# Altium project ARDUINO_NANO_02_V03.PrjPcb
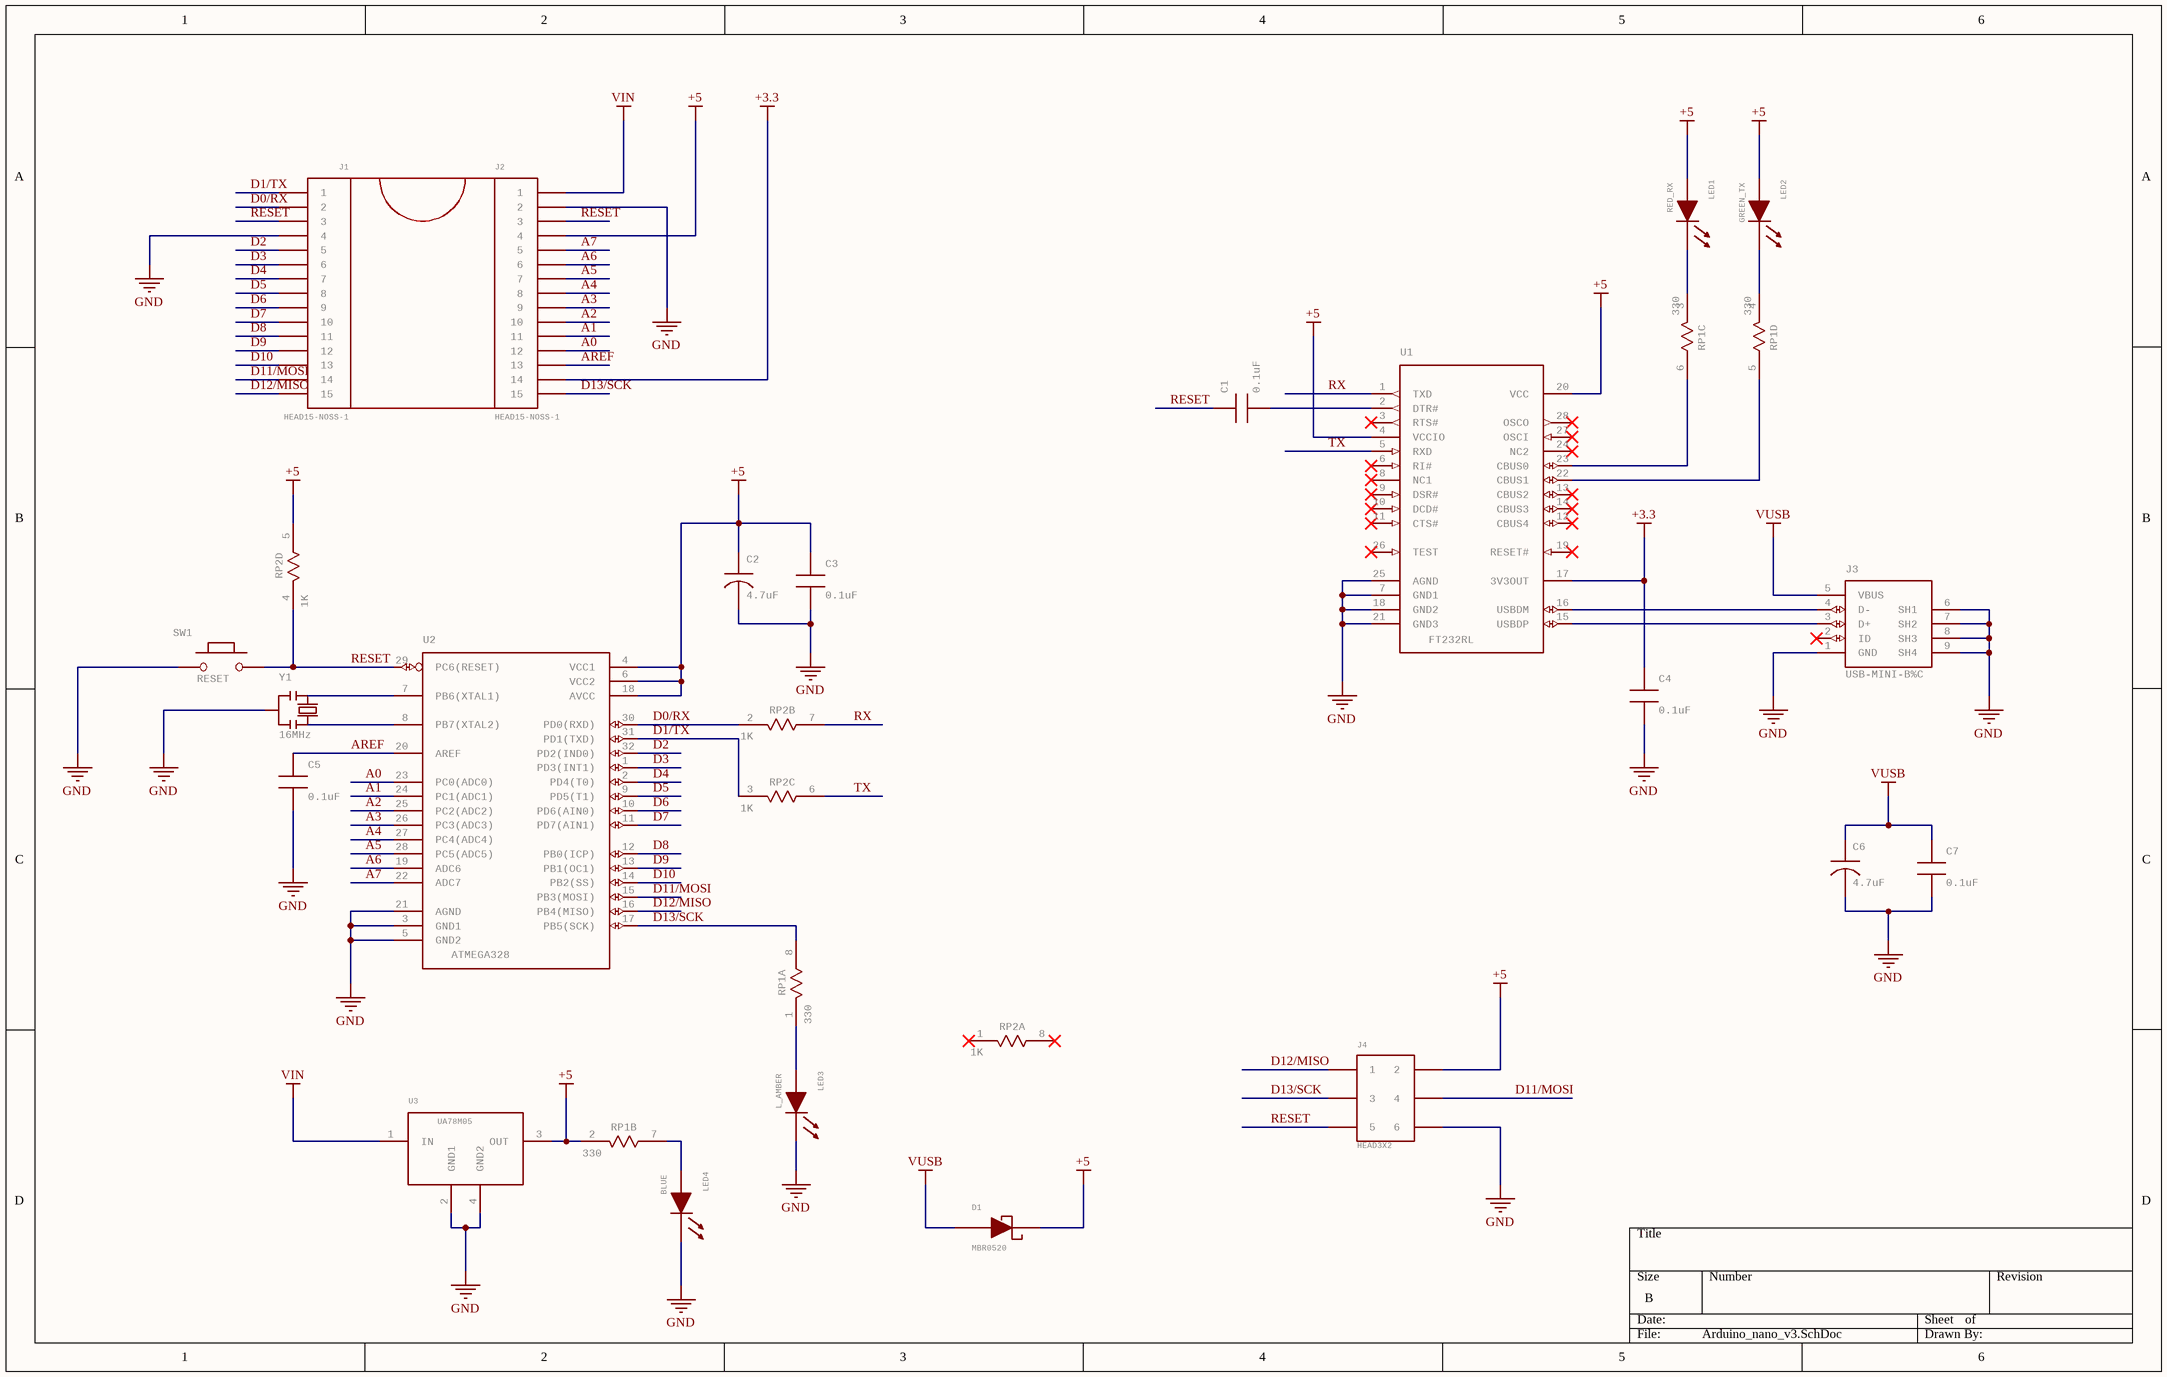
[diagram p0: Arduino_nano_v3.SchDoc]
1 sheet, 23 parts. Net scope: global (net labels, ports and power ports of the same name join across sheets).
Board files: PCB1.PcbDoc, PCB2.PcbDoc, PCBLASTATEMP.PcbDoc

## Sheet Arduino_nano_v3.SchDoc
size B; SheetNumber: 1; SheetTotal: 1

### Parts
C1  0.1uF  [CAP0805-NP]
C2  4.7uF  [TAN-A]
C3  0.1uF  [CAP0805-NP]
C4  0.1uF  [CAP0805-NP]
C5  0.1uF  [CAP0805-NP]
C6  4.7uF  [TAN-A]
C7  0.1uF  [CAP0805-NP]
D1  MBR0520  [SOD-123]
J1  HEAD15-NOSS-1  [HEAD15-NOSS-1]
J2  HEAD15-NOSS-1  [HEAD15-NOSS-1]
J3  USB-MINI-B%C  [USB-MINI-B_2]
J4  HEAD3X2  [HEAD3X2]
LED1  RED_RX  [LED0805]
LED2  GREEN_TX  [LED0805]
LED3  L_AMBER  [LED0805]
LED4  BLUE  [LED0805]
RP1  330  [RES4NT]  (parts A,B,C,D of 4)
RP2  1K  [RES4NT]  (parts A,B,C,D of 4)
SW1  RESET  [157SW]
U1  FT232RL  [SSOP28]
U2  ATMEGA328  [QFP032]
U3  UA78M05  [SOT223]
Y1  16MHz  [RESONATOR]

### Nets
+3.3: C4.1 J2.14 U1.17(3V3OUT)
+5: C2.1 C3.1 D1.1(CA) J2.4 J4.2 LED1.2(AN) LED2.2(AN) RP1.2 RP2.5 U1.4(VCCIO) U1.20(VCC) U2.4(VCC1) U2.6(VCC2) U2.18(AVCC) U3.3(OUT)
GND: C2.2 C3.2 C4.2 C5.2 C6.2 C7.2 J1.4 J2.2 J3.1(GND) J3.6(SH1) J3.7(SH2) J3.8(SH3) J3.9(SH4) J4.6 LED3.1(CA) LED4.1(CA) SW1.1 U1.7(GND1) U1.18(GND2) U1.21(GND3) U1.25(AGND) U2.3(GND1) U2.5(GND2) U2.21(AGND) U3.2(GND1) U3.4(GND2) Y1.2
VIN: J2.1 U3.1(IN)
VUSB: C6.1 C7.1 D1.2(AN) J3.5(VBUS)
A0: J2.12 U2.23(PC0(ADC0))
A1: J2.11 U2.24(PC1(ADC1))
A2: J2.10 U2.25(PC2(ADC2))
A3: J2.9 U2.26(PC3(ADC3))
A4: J2.8 U2.27(PC4(ADC4))
A5: J2.7 U2.28(PC5(ADC5))
A6: J2.6 U2.19(ADC6)
A7: J2.5 U2.22(ADC7)
AREF: C5.1 J2.13 U2.20(AREF)
D0/RX: J1.2 RP2.2 U2.30(PD0(RXD))
D1/TX: J1.1 RP2.3 U2.31(PD1(TXD))
D2: J1.5 U2.32(PD2(IND0))
D3: J1.6 U2.1(PD3(INT1))
D4: J1.7 U2.2(PD4(T0))
D5: J1.8 U2.9(PD5(T1))
D6: J1.9 U2.10(PD6(AIN0))
D7: J1.10 U2.11(PD7(AIN1))
D8: J1.11 U2.12(PB0(ICP))
D9: J1.12 U2.13(PB1(OC1))
D10: J1.13 U2.14(PB2(SS))
D11/MOSI: J1.14 J4.4 U2.15(PB3(MOSI))
D12/MISO: J1.15 J4.1 U2.16(PB4(MISO))
D13/SCK: J2.15 J4.3 RP1.8 U2.17(PB5(SCK))
RESET: C1.1 J1.3 J2.3 J4.5 RP2.4 SW1.2 U2.29(PC6(RESET))
RX: RP2.7 U1.1(TXD)
TX: RP2.6 U1.5(RXD)
NetC1_2: C1.2 U1.2(DTR#)
NetJ3_3: J3.3(D+) U1.15(USBDP)
NetJ3_4: J3.4(D-) U1.16(USBDM)
NetLED1_1: LED1.1(CA) RP1.3
NetLED2_1: LED2.1(CA) RP1.4
NetLED3_2: LED3.2(AN) RP1.1
NetLED4_2: LED4.2(AN) RP1.7
NetRP1_5: RP1.5 U1.22(CBUS1)
NetRP1_6: RP1.6 U1.23(CBUS0)
NetU2_7: U2.7(PB6(XTAL1)) Y1.1
NetU2_8: U2.8(PB7(XTAL2)) Y1.3

Not connected (* = marked no-connect by the designer): J3 2(ID)*; RP2 1* 8(2)*; U1 3(RTS#)* 6(RI#)* 8(NC1)* 9(DSR#)* 10(DCD#)* 11(CTS#)* 12(CBUS4)* 13(CBUS2)* 14(CBUS3)* 19(RESET#)* 24(NC2)* 26(TEST)* 27(OSCI)* 28(OSCO)*

### Library data of the parts
C1 C3-C5 C7 = CAP0805-NP: Capacitor 0.1uF, 10%,50V; Manufacturer: KEMET; Part Number: C0805C104K5RACTU; GateName_1: G$1; SymbolName_1: CAP-NP; LibraryName: MySMD; DeviceSetName: CAP0805-NP
C2 C6 = CAP-TANA-P: Capacitor 4.7uF,10%,20V,TANT-A; Manufacturer: AVX; Part Number: TPSA475K020R1800; GateName_1: G$1; SymbolName_1: CAP-P; LibraryName: MySMD; DeviceSetName: CAP-TANA-P
D1 = MBR0520: MBR0520 SOD-123; Manufacturer: ON Semiconductor; Part Number: MBR0520LT1G; GateName_1: G$1; SymbolName_1: SCHOTTKY; LibraryName: MySMD; DeviceSetName: MBR0520
J1 J2 = HEAD15-NOSS-1: HEAD15-NOSS 2.54mm; Manufacturer: MOLEX; GateName_1: G$1; SymbolName_1: HEAD15-NOSS; LibraryName: MyCON2; DeviceSetName: HEAD15-NOSS-1; Part Number: 22-03-2151
J3 = USB-MINI-B: Manufacturer: TE; Part Number: 1734035-2; GateName_1: G$1; SymbolName_1: USB; DeviceName: %C; LibraryName: MyCON2; DeviceSetName: USB-MINI-B
J4 = HEAD3X2: HEAD3X2 2.54mm; Manufacturer: 3M; Part Number: 961206-6404-AR; GateName_1: G$1; SymbolName_1: HEAD3X2; LibraryName: MyCON2; DeviceSetName: HEAD3X2
LED1 = LED0805_RED_LH-R974_OSRAM: RED_RX LED0805; Manufacturer: OS RAM; Part Number: LH R974; GateName_1: G$1; SymbolName_1: LED; LibraryName: MySMD; DeviceSetName: LED0805
LED2 = LED0805_LTST-C171GKT_LITE-ON: GREEN_TX LED0805; GateName_1: G$1; SymbolName_1: LED; LibraryName: MySMD; DeviceSetName: LED0805; Manufacturer: LITE-ON; Part Number: LTST-C171GKT
LED3 = LED0805_LTST-C171AKT_LITE-ON: L_AMBER LED0805; GateName_1: G$1; SymbolName_1: LED; LibraryName: MySMD; DeviceSetName: LED0805; Manufacturer: LITE-ON; Part Number: LTST-C171AKT
LED4 = LED0805_LTST-C170TBKT_LITE-ON: BLUE LED0805; GateName_1: G$1; SymbolName_1: LED; LibraryName: MySMD; DeviceSetName: LED0805; Manufacturer: LITE-ON; Part Number: LTST-C170TBKT
RP1 = RES4NT_1: 330 RES4NT; Manufacturer: Panasonic; Part Number: EXB38V331JV; GateName_1: A; GateName_2: B; GateName_3: C; GateName_4: D; SymbolName_1: RES4NT; SymbolName_2: RES4NT; SymbolName_3: RES4NT; SymbolName_4: RES4NT; LibraryName: MySMD; DeviceSetName: RES4NT
RP2 = RES4NT: 1K RES4NT; Manufacturer: Panasonic; Part Number: EXB38V102JV; GateName_1: A; GateName_2: B; GateName_3: C; GateName_4: D; SymbolName_1: RES4NT; SymbolName_2: RES4NT; SymbolName_3: RES4NT; SymbolName_4: RES4NT; LibraryName: MySMD; DeviceSetName: RES4NT
SW1 = PB157: RESET PB157 157SW; Manufacturer: OMRON; Part Number: B3U-1000P; GateName_1: G$1; SymbolName_1: PBSWITCH; LibraryName: MySMD; DeviceSetName: PB157
U1 = FT232RL: FT232RL FT232RL SSOP28; Manufacturer: FTDI; GateName_1: G$1; SymbolName_1: FL232RL; LibraryName: MySMD2; DeviceSetName: FT232RL; Part Number: FT232RL
U2 = ATMEGA168-20AU: ATMEGA328P-AU ATMEGA168-20AU QFP032; Manufacturer: Microchip; GateName_1: G$1; SymbolName_1: ATMEGA168-20AU; LibraryName: MySMD; DeviceSetName: ATMEGA168-20AU; Part Number: ATMEGA328P-AU
U3 = UA78M05: UA78M05 SOT223; Manufacturer: TI; Part Number: UA78M05CDCY; GateName_1: G$1; SymbolName_1: UA78M05; LibraryName: MySMD; DeviceSetName: UA78M05
Y1 = RESONATORMU: 16MHz RESONATOR; Manufacturer: Murata; Part Number: CSTCE16M0V53A-R0; GateName_1: G$1; DeviceName: MU; SymbolName_1: RESONATOR; LibraryName: MySMD2; DeviceSetName: RESONATOR